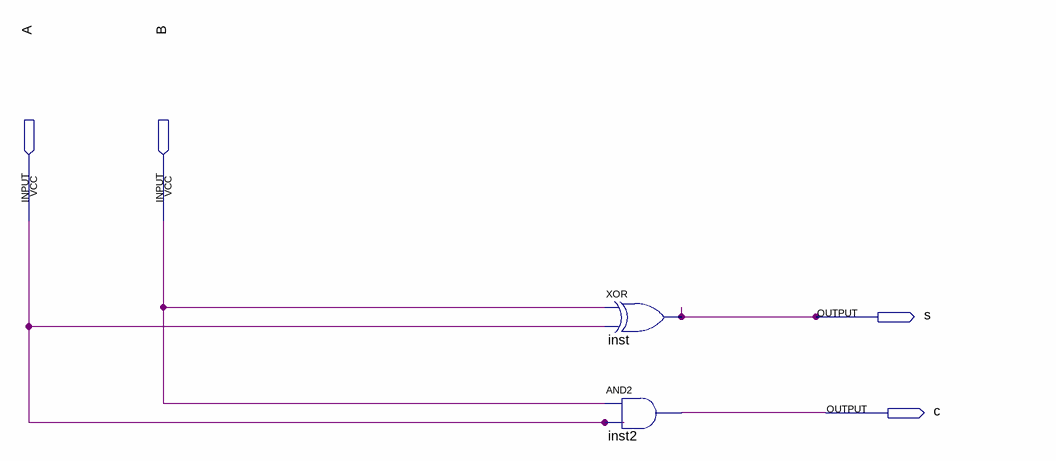
[diagram p0: schematic sheet]
// Quartus schematic HA.bdf as structural Verilog: 2 symbols, 4 pins
module HA (
  input  A,
  input  B,
  output s,
  output c
);

  xor inst (s, B, A);
  and inst2 (c, B, A);
endmodule
